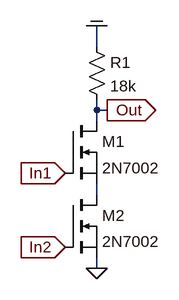
[diagram p0: schematic nm_nand.asc]
nm_nand.asc, the LTspice schematic file:
Version 4
SHEET 1 880 680
WIRE 224 32 224 0
WIRE 224 128 224 112
WIRE 240 128 224 128
WIRE 224 144 224 128
WIRE 224 256 224 240
WIRE 224 368 224 352
FLAG 176 224 In1
IOPIN 176 224 In
FLAG 240 128 Out
IOPIN 240 128 Out
FLAG 224 0 COM
FLAG 224 368 0
FLAG 176 336 In2
IOPIN 176 336 In
SYMBOL nmos 176 144 R0
SYMATTR InstName M1
SYMATTR Value 2N7002
SYMBOL res 208 16 R0
SYMATTR InstName R1
SYMATTR Value 18k
SYMBOL nmos 176 256 R0
SYMATTR InstName M2
SYMATTR Value 2N7002

The netlist it stands for:
* nm_nand.asc
M1 Out In1 N001 N001 2N7002
R1 COM Out 18k
M2 N001 In2 0 0 2N7002
.model NMOS NMOS
.model PMOS PMOS
.lib standard.mos
.backanno
.end